# EAGLE schematic SMD_Breakout (EAGLE 7.3.0)
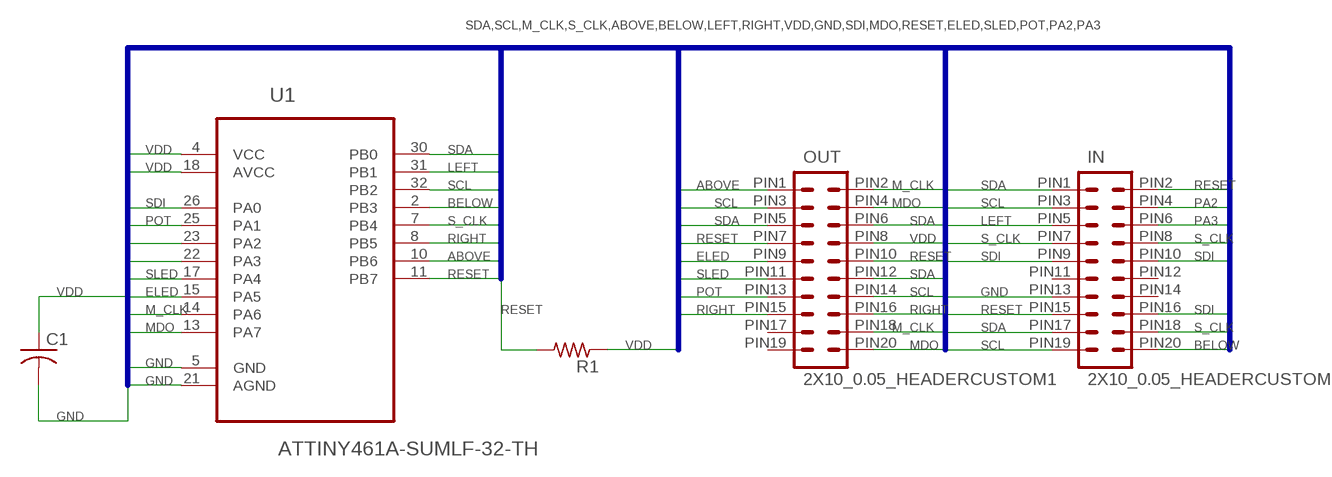
[diagram p0: schematic, sheet 1]

## Parts
C1  C-USC0603  [C0603]
IN  2X10_0.05_HEADERCUSTOM1  [2X10_CUSTOM]
OUT  2X10_0.05_HEADERCUSTOM1  [2X10_CUSTOM]
R1  R-US_R0603  [R0603]
U1  ATTINY461A-SUMLF-32-TH  [MLF32-TH]

## Nets
ABOVE: OUT.PIN1 U1.10(PB6)
BELOW: IN.PIN20 U1.2(PB3)
ELED: OUT.PIN9 U1.15(PA5)
GND: C1.2 IN.PIN13 U1.5(GND) U1.21(AGND)
LEFT: IN.PIN5 U1.31(PB1)
M_CLK: OUT.PIN2 OUT.PIN18 U1.14(PA6)
MDO: OUT.PIN4 OUT.PIN20 U1.13(PA7)
PA2: IN.PIN4 U1.23(PA2)
PA3: IN.PIN6 U1.22(PA3)
POT: OUT.PIN13 U1.25(PA1)
RESET: IN.PIN2 IN.PIN15 OUT.PIN7 OUT.PIN10 R1.2 U1.11(PB7)
RIGHT: OUT.PIN15 OUT.PIN16 U1.8(PB5)
S_CLK: IN.PIN7 IN.PIN8 IN.PIN18 U1.7(PB4)
SCL: IN.PIN3 IN.PIN19 OUT.PIN3 OUT.PIN14 U1.32(PB2)
SDA: IN.PIN1 IN.PIN17 OUT.PIN5 OUT.PIN6 OUT.PIN12 U1.30(PB0)
SDI: IN.PIN9 IN.PIN10 IN.PIN16 U1.26(PA0)
SLED: OUT.PIN11 U1.17(PA4)
VDD: C1.1 OUT.PIN8 R1.1 U1.4(VCC) U1.18(AVCC)
Unconnected: IN.PIN11 IN.PIN12 IN.PIN14 OUT.PIN17 OUT.PIN19

## Buses
SDA,SCL,M_CLK,S_CLK,ABOVE,BELOW,LEFT,RIGHT,VDD,GND,SDI,MDO,RESET,ELED,SLED,POT,PA2,PA3

## Library data of the parts
C1 = rcl:C-US: CAPACITOR, American symbol
IN OUT = Custom:2X10_0.05_HEADER
R1 = rcl:R-US_: RESISTOR, American symbol
U1 = Atmel_By_element14_Batch_1-00:ATTINY461A-SU: 8-bit Microcontroller with In-System Programmable Flash